# EAGLE design PowerTransmitter (EAGLE 7.5.0)
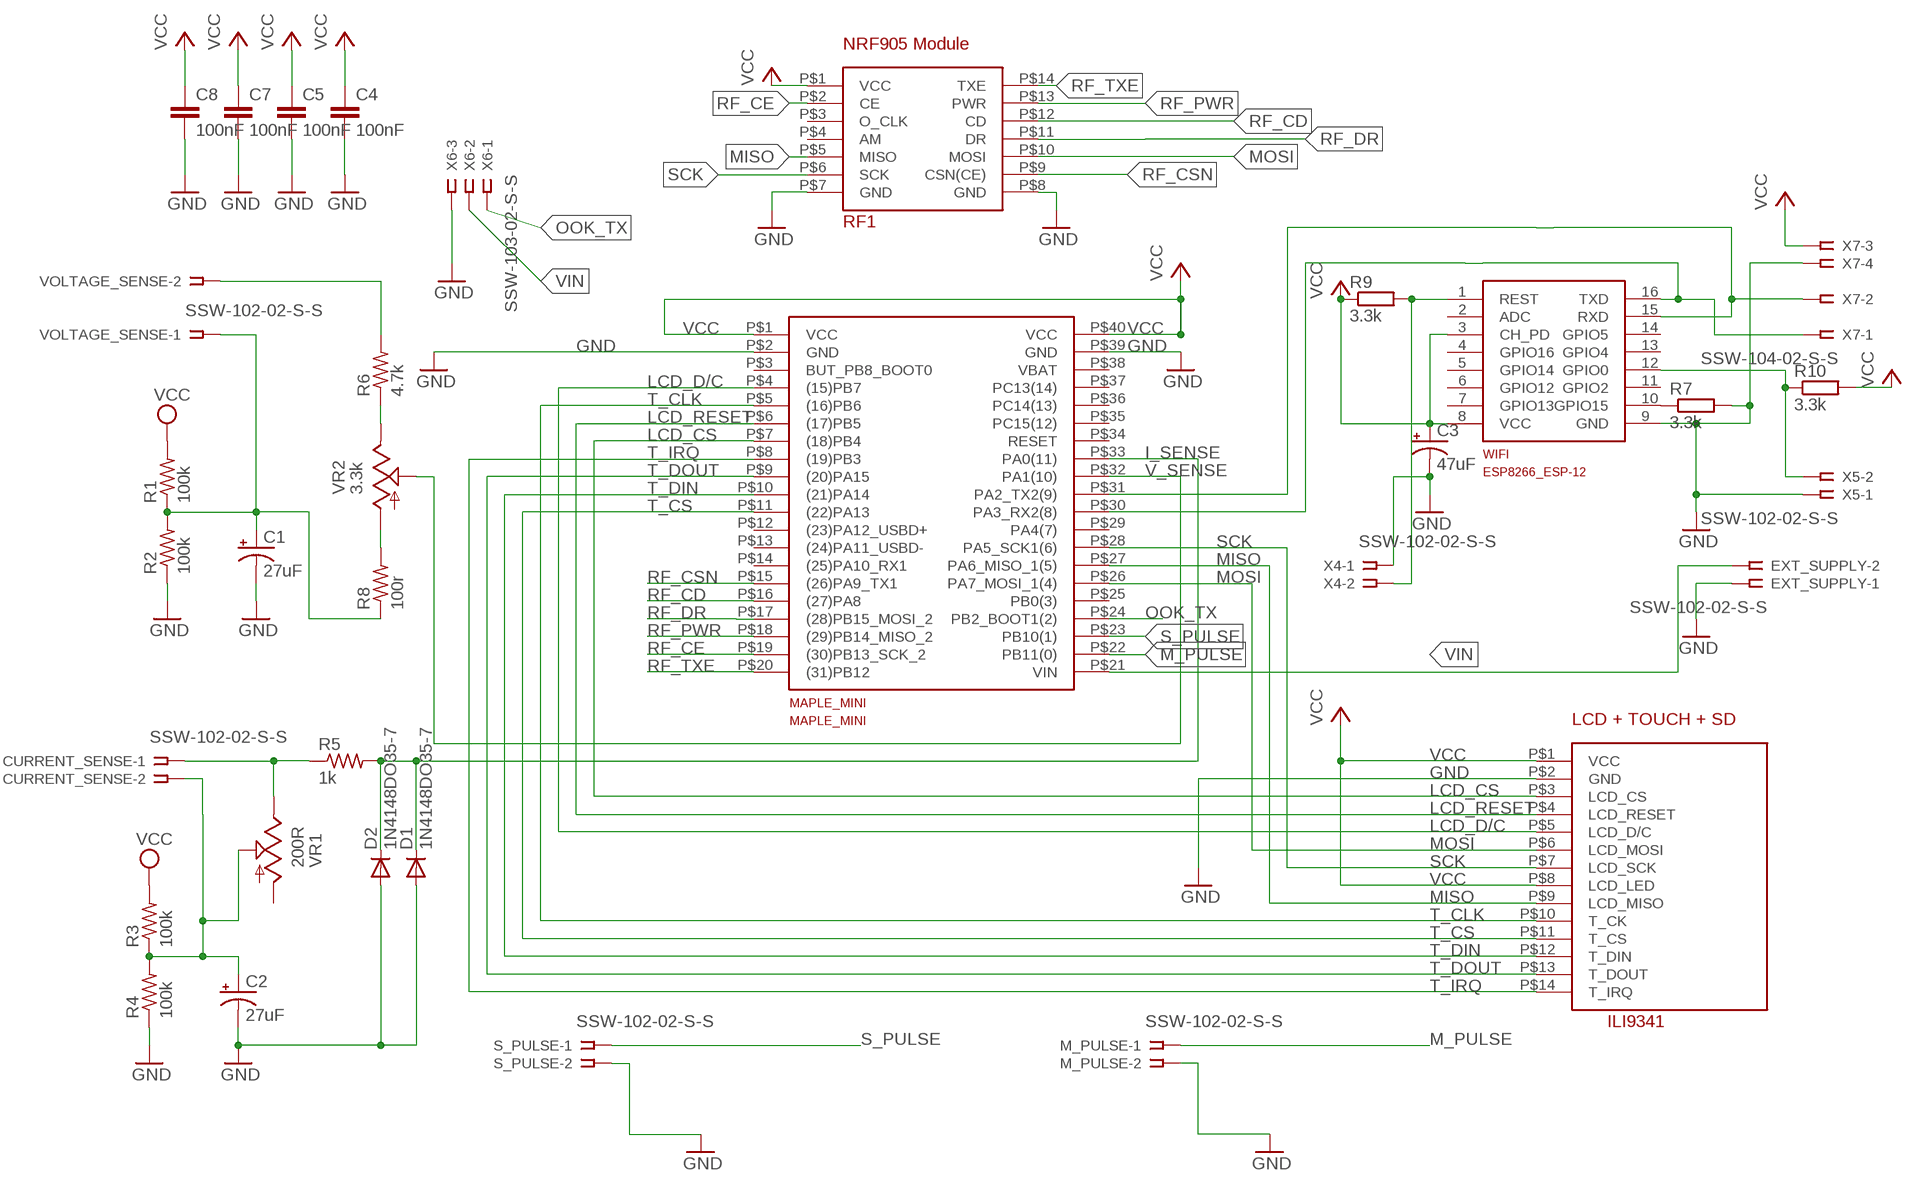
[diagram p0: schematic, sheet 1]

## Parts
C1  27uF  CPOL-USE5-8.5  [E5-8,5]
C2  27uF  CPOL-USE5-8.5  [E5-8,5]
C3  47uF  CPOL-USE5-8.5  [E5-8,5]
C4  100nF  C-EU050-035X075  [C050-035X075]
C5  100nF  C-EU050-035X075  [C050-035X075]
C7  100nF  C-EU050-035X075  [C050-035X075]
C8  100nF  C-EU050-035X075  [C050-035X075]
CURRENT_SENSE  SSW-102-02-S-S  [SSW-102-02-S-S]
D1  1N4148DO35-7  [DO35-7]
D2  1N4148DO35-7  [DO35-7]
EXT_SUPPLY  SSW-102-02-S-S  [SSW-102-02-S-S]
ILI9341  ILI9341_TOUCH_SD  [2.4_INCH]
M_PULSE  SSW-102-02-S-S  [SSW-102-02-S-S]
MAPLE_MINI  MAPLE_MINI  [MAPLE_MINI]
R1  100k  R-US_0207/10  [0207/10]
R2  100k  R-US_0207/10  [0207/10]
R3  100k  R-US_0207/10  [0207/10]
R4  100k  R-US_0207/10  [0207/10]
R5  1k  R-US_0207/10  [0207/10]
R6  4.7k  R-US_0207/10  [0207/10]
R7  3.3k  R-EU_0207/2V  [0207/2V]
R8  100r  R-US_0207/10  [0207/10]
R9  3.3k  R-EU_0207/2V  [0207/2V]
R10  3.3k  R-EU_0207/2V  [0207/2V]
RF1  NRF905_MODULE  [PIN14]
S_PULSE  SSW-102-02-S-S  [SSW-102-02-S-S]
VOLTAGE_SENSE  SSW-102-02-S-S  [SSW-102-02-S-S]
VR1  200R  TRIM_US-CA9V  [CA9V]
VR2  3.3k  TRIM_US-CA9V  [CA9V]
WIFI  ESP8266-12  ESP8266-12GPIO04/05_CORRECTED  [ESP8266-ESP12]
X4  SSW-102-02-S-S  [SSW-102-02-S-S]
X5  SSW-102-02-S-S  [SSW-102-02-S-S]
X6  SSW-103-02-S-S  [SSW-103-02-S-S]
X7  SSW-104-02-S-S  [SSW-104-02-S-S]

## Nets
GND: C1.- C2.- C3.- C4.2 C5.2 C7.2 C8.2 D1.A D2.A EXT_SUPPLY.1 ILI9341.P$2(GND) M_PULSE.2 MAPLE_MINI.P$2(GND) MAPLE_MINI.P$39(GND) R2.1 R4.1 R7.2 RF1.P$7(GND) RF1.P$8(GND) S_PULSE.2 WIFI.9(GND) X4.1 X5.1 X6.3 X7.4
I_SENSE: D1.C D2.C MAPLE_MINI.P$33(PA0(11)) R5.2
LCD_CS: ILI9341.P$3(LCD_CS) MAPLE_MINI.P$7((18)PB4)
LCD_D/C: ILI9341.P$5(LCD_D/C) MAPLE_MINI.P$4((15)PB7)
LCD_RESET: ILI9341.P$4(LCD_RESET) MAPLE_MINI.P$6((17)PB5)
M_PULSE: M_PULSE.1 MAPLE_MINI.P$22(PB11(0))
MISO: ILI9341.P$9(LCD_MISO) MAPLE_MINI.P$27(PA6_MISO_1(5)) RF1.P$5(MISO)
MOSI: ILI9341.P$6(LCD_MOSI) MAPLE_MINI.P$26(PA7_MOSI_1(4)) RF1.P$10(MOSI)
N$1: C1.+ R1.1 R2.2 R8.1 VOLTAGE_SENSE.1
N$2: MAPLE_MINI.P$30(PA3_RX2(8)) WIFI.16(TXD) X7.1
N$3: MAPLE_MINI.P$31(PA2_TX2(9)) WIFI.15(RXD) X7.2
N$4: R6.1 VR2.E
N$5: R6.2 VOLTAGE_SENSE.2
N$6: R8.2 VR2.A
N$7: R7.1 WIFI.10(GPIO15)
N$9: CURRENT_SENSE.1 R5.1 VR1.E
N$11: R9.2 WIFI.1(REST) X4.2
N$12: C2.+ CURRENT_SENSE.2 R3.1 R4.2 VR1.S
N$13: R10.1 WIFI.12(GPIO0) X5.2
OOK_TX: MAPLE_MINI.P$24(PB2_BOOT1(2)) X6.1
RF_CD: MAPLE_MINI.P$16((27)PA8) RF1.P$12(CD)
RF_CE: MAPLE_MINI.P$19((30)PB13_SCK_2) RF1.P$2(CE)
RF_CSN: MAPLE_MINI.P$15((26)PA9_TX1) RF1.P$9(CSN(CE))
RF_DR: MAPLE_MINI.P$17((28)PB15_MOSI_2) RF1.P$11(DR)
RF_PWR: MAPLE_MINI.P$18((29)PB14_MISO_2) RF1.P$13(PWR)
RF_TXE: MAPLE_MINI.P$20((31)PB12) RF1.P$14(TXE)
S_PULSE: MAPLE_MINI.P$23(PB10(1)) S_PULSE.1
SCK: ILI9341.P$7(LCD_SCK) MAPLE_MINI.P$28(PA5_SCK1(6)) RF1.P$6(SCK)
T_CLK: ILI9341.P$10(T_CK) MAPLE_MINI.P$5((16)PB6)
T_CS: ILI9341.P$11(T_CS) MAPLE_MINI.P$11((22)PA13)
T_DIN: ILI9341.P$12(T_DIN) MAPLE_MINI.P$10((21)PA14)
T_DOUT: ILI9341.P$13(T_DOUT) MAPLE_MINI.P$9((20)PA15)
T_IRQ: ILI9341.P$14(T_IRQ) MAPLE_MINI.P$8((19)PB3)
V_SENSE: MAPLE_MINI.P$32(PA1(10)) VR2.S
VCC: C3.+ C4.1 C5.1 C7.1 C8.1 ILI9341.P$1(VCC) ILI9341.P$8(LCD_LED) MAPLE_MINI.P$1(VCC) MAPLE_MINI.P$40(VCC) R1.2 R3.2 R9.1 R10.2 RF1.P$1(VCC) WIFI.3(CH_PD) WIFI.8(VCC) X7.3
VIN: EXT_SUPPLY.2 MAPLE_MINI.P$21(VIN) X6.2
Unconnected: MAPLE_MINI.P$3(BUT_PB8_BOOT0) MAPLE_MINI.P$12((23)PA12_USBD+) MAPLE_MINI.P$13((24)PA11_USBD-) MAPLE_MINI.P$14((25)PA10_RX1) MAPLE_MINI.P$25(PB0(3)) MAPLE_MINI.P$29(PA4(7)) MAPLE_MINI.P$34(RESET) MAPLE_MINI.P$35(PC15(12)) MAPLE_MINI.P$36(PC14(13)) MAPLE_MINI.P$37(PC13(14)) MAPLE_MINI.P$38(VBAT) RF1.P$3(O_CLK) RF1.P$4(AM) VR1.A WIFI.2(ADC) WIFI.4(GPIO16) WIFI.5(GPIO14) WIFI.6(GPIO12) WIFI.7(GPIO13) WIFI.11(GPIO2) WIFI.13(GPIO4) WIFI.14(GPIO5)

## Library data of the parts
C1-C3 = rcl:CPOL-US: POLARIZED CAPACITOR, American symbol
C4 C5 C7 C8 = rcl:C-EU: CAPACITOR, European symbol
CURRENT_SENSE M_PULSE S_PULSE = con-samtec:SSW-102-02-S-S: THROUGH-HOLE .025" SQ POST SOCKET Source: Samtec SSW.pdf; MPN: S1; OC_FARNELL: unknown; OC_NEWARK: 11P9351
D1 D2 = diode:1N4148: DIODE high speed (Philips)
EXT_SUPPLY VOLTAGE_SENSE X4 X5 = con-samtec:SSW-102-02-S-S: THROUGH-HOLE .025" SQ POST SOCKET Source: Samtec SSW.pdf; MPN: SSW-102-02-S-S; OC_FARNELL: unknown; OC_NEWARK: 11P9351
ILI9341 = maple_mini:ILI9341_TOUCH_SD: LCD panel with touch screen and SD card socket
MAPLE_MINI = maple_mini:MAPLE_MINI
R1-R6 R8 = resistor:R-US_: RESISTOR, American symbol
R7 R9 R10 = rcl:R-EU_: RESISTOR, European symbol
RF1 = maple_mini:NRF905_MODULE
VR1 VR2 = pot:TRIM_US-: POTENTIOMETER
WIFI = maple_mini:ESP8266-12: Espressif ESP8266 ESP-12 Module with GPIO04 and GPIO05 corrected.
X6 = con-samtec:SSW-103-02-S-S: THROUGH-HOLE .025" SQ POST SOCKET Source: Samtec SSW.pdf; MPN: SSW-103-02-S-S; OC_FARNELL: unknown; OC_NEWARK: 11P9367
X7 = con-samtec:SSW-104-02-S-S: THROUGH-HOLE .025" SQ POST SOCKET Source: Samtec SSW.pdf; MPN: SSW-104-02-S-S; OC_FARNELL: unknown; OC_NEWARK: 11P9384

## Net classes
0 default: width 0.013 mm, drill 0.025 mm, clearance 0.006 mm

## Board
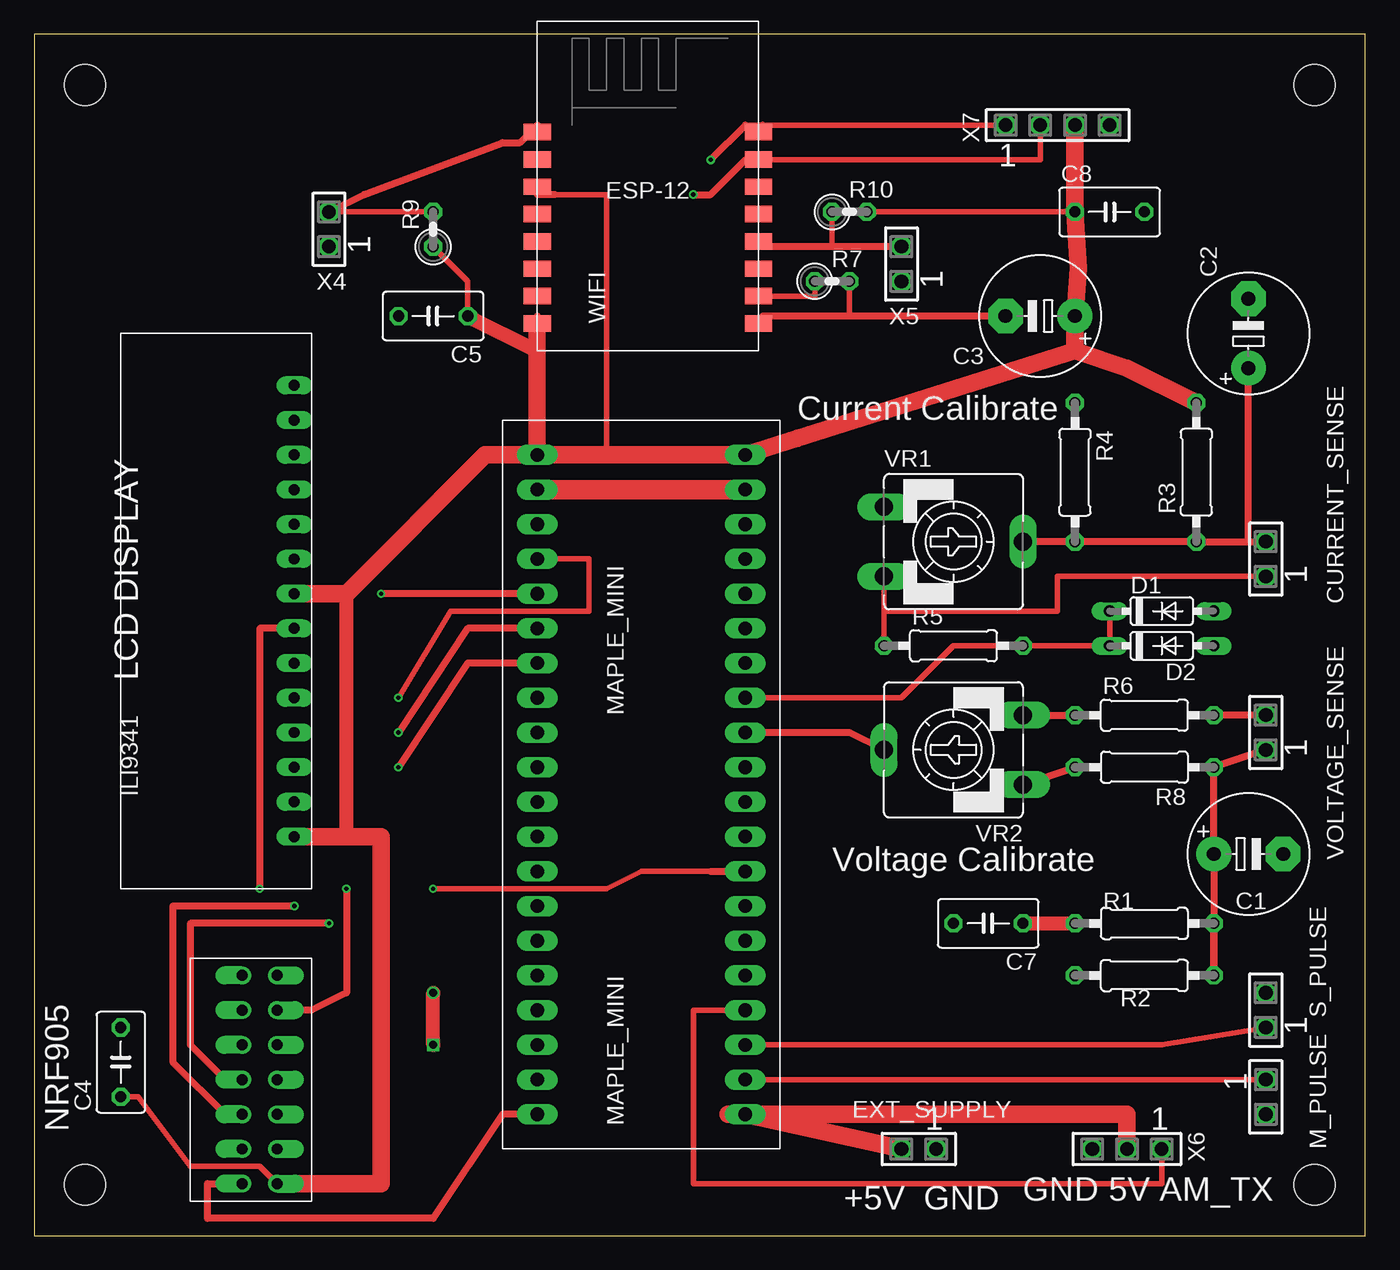
[diagram p1: board, top side]
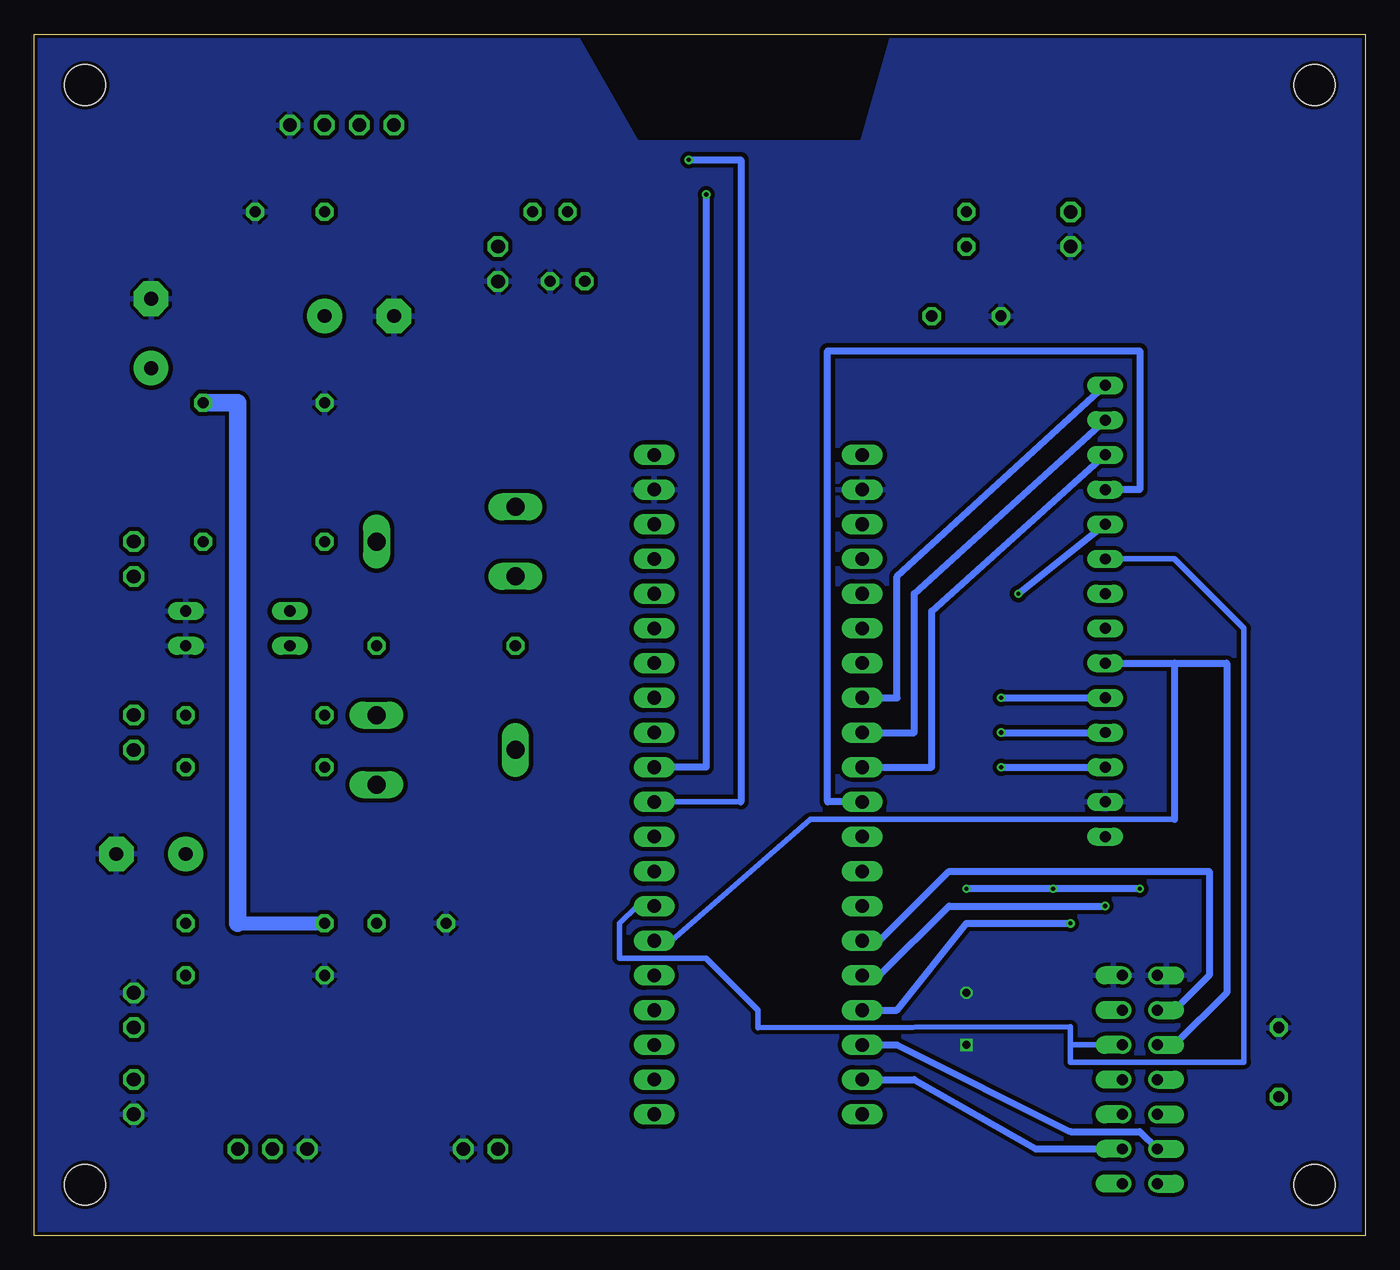
[diagram p2: board, bottom side, seen from below]

Size 97.46 x 87.94 mm. Coordinates in mm from the lower left corner, seen from the top.
Outline: 0,0 97.46,0 97.46,87.94 0,87.94 0,0
Copper layers (1*16): Top 0.035mm / dielectric 1.5mm / Bottom 0.035mm
Design rules "dirt_cheap_dirty_boards.v1 *": minimum track width 5mil, minimum drill 12mil, track to track 12mil, track to pad 12mil, pad to pad 12mil, via to via 12mil, smd to smd 0mil, copper to edge 10mil, drill to drill 10mil, minimum pad ring 10mil, minimum via ring 6mil, stop-mask expansion 2mil, vias tented up to drill 25mil, thermal gap 10mil
Holes 3 mm at 3.73,84.21 93.73,84.21 93.73,3.73 3.73,3.73

### Footprints (pad centres in the part's own frame; a part is rotated, then mirrored left to right if it is on the bottom)
E5-8,5 = drill 1.016 pad 2.54: + -2.54,0 | drill 1.016 pad 2.54 octagon: - 2.54,0
C050-035X075 = drill 0.813 octagon: 1 -2.54,0; 2 2.54,0
SSW-102-02-S-S = drill 1 pad 1.5 octagon: 1 -1.27,0; 2 1.27,0
DO35-7 = drill 0.813 long: A 3.81,0; C -3.81,0
2.4_INCH = drill 0.8 long: P$1 0,0; P$2 0,-2.54; P$3 0,-5.08; P$4 0,-7.62; P$5 0,-10.16; P$6 0,-12.7; P$7 0,-15.24; P$8 0,-17.78; P$9 0,-20.32; P$10 0,-22.86; P$11 0,-25.4; P$12 0,-27.94; P$13 0,-30.48; P$14 0,-33.02
MAPLE_MINI = drill 1 long: P$1 0,0; P$2 0,-2.54; P$3 0,-5.08; P$4 0,-7.62; P$5 0,-10.16; P$6 0,-12.7; P$7 0,-15.24; P$8 0,-17.78; P$9 0,-20.32; P$10 0,-22.86; P$11 0,-25.4; P$12 0,-27.94; P$13 0,-30.48; P$14 0,-33.02; P$15 0,-35.56; P$16 0,-38.1; P$17 0,-40.64; P$18 0,-43.18; P$19 0,-45.72; P$20 0,-48.26; P$21 15.24,-48.26; P$22 15.24,-45.72; P$23 15.24,-43.18; P$24 15.24,-40.64; P$25 15.24,-38.1; P$26 15.24,-35.56; P$27 15.24,-33.02; P$28 15.24,-30.48; P$29 15.24,-27.94; P$30 15.24,-25.4; P$31 15.24,-22.86; P$32 15.24,-20.32; P$33 15.24,-17.78; P$34 15.24,-15.24; P$35 15.24,-12.7; P$36 15.24,-10.16; P$37 15.24,-7.62; P$38 15.24,-5.08; P$39 15.24,-2.54; P$40 15.24,0
0207/10 = drill 0.813 octagon: 1 -5.08,0; 2 5.08,0
0207/2V = drill 0.813 octagon: 1 -1.27,0; 2 1.27,0
PIN14 = drill 0.8 offset: P$1 0,0; P$2 0,-2.54; P$3 0,-5.08; P$4 0,-7.62; P$5 0,-10.16; P$6 0,-12.7; P$7 0,-15.24; P$8 2.54,-15.24; P$9 2.54,-12.7; P$10 2.54,-10.16; P$11 2.54,-7.62; P$12 2.54,-5.08; P$13 2.54,-2.54; P$14 2.54,0
CA9V = drill 1.321 long: A -2.54,-5.08; E 2.54,-5.08; S 0,5.08
ESP8266-ESP12 = smd 2 x 1.2: 1 0,16; 2 0,14; 3 0,12; 4 0,10; 5 0,8; 6 0,6; 7 0,4; 8 0,2; 9 16.2,2; 10 16.2,4; 11 16.2,6; 12 16.2,8; 13 16.2,10; 14 16.2,12; 15 16.2,14; 16 16.2,16
SSW-103-02-S-S = drill 1 pad 1.5 octagon: 1 -2.54,0; 2 0,0; 3 2.54,0
SSW-104-02-S-S = drill 1 pad 1.5 octagon: 1 -3.81,0; 2 -1.27,0; 3 1.27,0; 4 3.81,0

### Placement (x,y rotation side)
C1  88.9,27.94 0 top
C2  88.9,66.04 90 top
C3  73.66,67.31 180 top
C4  6.35,12.7 90 top
C5  29.21,67.31 180 top
C7  69.85,22.86 180 top
C8  78.74,74.93 0 top
CURRENT_SENSE  90.17,49.53 90 top
D1  82.55,45.72 0 top
D2  82.55,43.18 0 top
EXT_SUPPLY  64.77,6.35 180 top
ILI9341  19.05,29.21 180 top
M_PULSE  90.17,10.16 270 top
MAPLE_MINI  36.83,57.15 0 top
R1  81.28,22.86 180 top
R2  81.28,19.05 0 top
R3  85.09,55.88 90 top
R4  76.2,55.88 270 top
R5  67.31,43.18 0 top
R6  81.28,38.1 0 top
R7  58.42,69.85 0 top
R8  81.28,34.29 180 top
R9  29.21,73.66 90 top
R10  59.69,74.93 0 top
RF1  17.78,3.81 180 top
S_PULSE  90.17,16.51 90 top
VOLTAGE_SENSE  90.17,36.83 90 top
VR1  67.31,50.8 270 top
VR2  67.31,35.56 90 top
WIFI  36.83,64.77 0 top
X4  21.59,73.66 90 top
X5  63.5,71.12 90 top
X6  80.01,6.35 180 top
X7  74.93,81.28 0 top

### Tracks (layer width: path | path; a pad name or v marks a point on that pad's centre or on a via)
GND  (via drill 0.6)
  Top 0.406: R7.2 59.69,67.31
  Top 0.508: C3.- 59.69,67.31 53.34,67.31 WIFI.9
  Top 1.016: v29.21,13.97 v29.21,17.78
  Top 1.422: MAPLE_MINI.P$2 MAPLE_MINI.P$39
  Bottom 0.508: MAPLE_MINI.P$39 52.07,54.66
  pour Bottom: -1.27,88.9 34.29,88.9 36.83,80.01 53.34,80.01 58.42,88.9 99.06,88.9 99.06,-2.54 -1.27,-2.54
I_SENSE
  Top 0.406: D1.C D2.C R5.2 67.31,43.18 63.5,39.37 MAPLE_MINI.P$33
LCD_CS  (via drill 0.3)
  Top 0.508: v26.67,34.29 31.75,41.91 MAPLE_MINI.P$7
  Bottom 0.508: v26.67,34.29 ILI9341.P$3
LCD_D/C  (via drill 0.3)
  Top 0.406: v26.67,39.37 30.48,45.72 40.64,45.72 40.64,49.53 MAPLE_MINI.P$4
  Bottom 0.508: v26.67,39.37 ILI9341.P$5
LCD_RESET  (via drill 0.3)
  Top 0.508: v26.67,36.83 31.75,44.45 MAPLE_MINI.P$6
  Bottom 0.508: v26.67,36.83 ILI9341.P$4
M_PULSE
  Top 0.406: M_PULSE.1 MAPLE_MINI.P$22
MISO
  Bottom 0.406: RF1.P$5 21.59,13.97 | MAPLE_MINI.P$27 53.34,24.13 54.61,22.86 54.61,20.32 48.26,20.32 44.45,16.51 44.45,15.24 21.59,15.29 21.59,13.97 | 21.59,13.97 21.59,12.7 8.89,12.7 8.89,44.45 13.97,49.53 ILI9341.P$9
MOSI
  Bottom 0.406: 50.8,21.59 40.64,30.48 13.97,30.48
  Bottom 0.508: RF1.P$10 13.97,13.97 10.16,17.78 10.16,41.91 13.97,41.91 | ILI9341.P$6 13.97,41.91 | 50.8,21.59 MAPLE_MINI.P$26 | 13.97,41.91 13.97,30.48
N$1
  Top 0.508: VOLTAGE_SENSE.1 R8.1 C1.+ R2.2 R1.1
N$2  (via drill 0.3)
  Top 0.406: X7.1 53.34,81.28 52.07,81.28
  Top 0.508: 53.34,81.28 WIFI.16 52.07,81.28 v49.53,78.74
  Bottom 0.406: 45.72,31.75 MAPLE_MINI.P$30
  Bottom 0.508: 45.72,31.75 45.72,78.74 v49.53,78.74
N$3  (via drill 0.3)
  Top 0.406: X7.2 73.66,78.74 53.34,78.74
  Top 0.508: 53.34,78.74 WIFI.15 52.07,78.74 49.53,76.2 v48.26,76.2
  Bottom 0.508: MAPLE_MINI.P$31 48.26,34.29 v48.26,76.2
N$4
  Top 0.508: VR2.E R6.1
N$5
  Top 0.508: VOLTAGE_SENSE.2 R6.2
N$6
  Top 0.508: VR2.A R8.2
N$7
  Top 0.406: WIFI.10 57.15,68.77 R7.1
N$8
  Top 0.406: 53.28,68.57 53.07,68.78
N$9
  Top 0.406: CURRENT_SENSE.1 74.93,48.26 74.93,45.72 62.23,45.72 VR1.E R5.1
N$11
  Top 0.406: R9.2 X4.2
  Top 0.508: X4.2 24.13,76.2 34.29,80.01 35.56,80.01 36.83,81.28 WIFI.1
N$12
  Top 0.508: 88.9,50.8 R3.1 R4.2 VR1.S | 88.9,50.8 CURRENT_SENSE.2 | 88.9,50.8 C2.+
N$13
  Top 0.406: R10.1 58.42,72.39
  Top 0.508: X5.2 58.42,72.39 53.34,72.39 WIFI.12
OOK_TX
  Top 0.406: X6.1 82.55,3.81 48.26,3.81 48.26,16.51 MAPLE_MINI.P$24
RF_CD  (via drill 0.3)
  Top 0.508: RF1.P$12 13.97,8.89 10.16,12.7 10.16,24.13 v19.05,24.13
  Bottom 0.508: v19.05,24.13 30.48,24.13 35.56,19.05 MAPLE_MINI.P$16
RF_CE
  Bottom 0.508: RF1.P$2 24.13,6.35 33.02,11.43 MAPLE_MINI.P$19
RF_CSN
  Bottom 0.508: RF1.P$9 13.97,16.51 11.43,19.05 11.43,26.67 30.48,26.67 35.56,21.59 MAPLE_MINI.P$15
RF_DR  (via drill 0.3)
  Top 0.508: RF1.P$11 13.97,11.43 11.43,13.97 11.43,22.86 v21.59,22.86
  Bottom 0.508: v21.59,22.86 29.21,22.86 34.29,16.51 MAPLE_MINI.P$17
RF_PWR
  Bottom 0.508: MAPLE_MINI.P$18 34.29,13.97 21.59,7.62 16.51,7.62 RF1.P$13
RF_TXE
  Top 0.508: RF1.P$14 12.7,3.81 12.7,1.27 29.21,1.27 34.29,8.89 MAPLE_MINI.P$20
S_PULSE
  Top 0.406: MAPLE_MINI.P$23 82.55,13.97 S_PULSE.1
SCK  (via drill 0.3)
  Top 0.406: 49.53,26.67 44.45,26.67 41.91,25.4 v29.21,25.4
  Top 0.508: RF1.P$6 20.32,16.51 22.86,17.78 v22.86,25.4 | v16.51,25.4 16.51,44.45 ILI9341.P$7 | 49.53,26.67 MAPLE_MINI.P$28
  Bottom 0.508: v16.51,25.4 v22.86,25.4 v29.21,25.4
T_CLK  (via drill 0.3)
  Top 0.508: MAPLE_MINI.P$5 v25.4,46.99
  Bottom 0.508: v25.4,46.99 ILI9341.P$10
T_CS
  Bottom 0.508: ILI9341.P$11 16.51,54.61 16.51,64.77 39.37,64.77 39.37,31.75 MAPLE_MINI.P$11
T_DIN
  Bottom 0.508: ILI9341.P$12 31.75,45.72 31.75,34.29 MAPLE_MINI.P$10
T_DOUT
  Bottom 0.508: ILI9341.P$13 33.02,46.99 33.02,36.83 MAPLE_MINI.P$9
T_IRQ
  Bottom 0.508: ILI9341.P$14 34.29,48.26 34.29,39.37 MAPLE_MINI.P$8
V_SENSE
  Top 0.508: MAPLE_MINI.P$32 59.69,36.83 VR2.S
VCC
  Top 0.406: RF1.P$1 16.51,5.08 11.43,5.08 7.62,10.16 C4.1 | 38.1,76.2 41.91,76.2 41.91,57.15 | C5.1 31.75,69.85 R9.1 | C8.1 R10.2
  Top 0.508: 19.05,3.81 RF1.P$1 | 36.83,67.31 WIFI.8 | MAPLE_MINI.P$1 35.56,57.15 | 38.1,76.2 36.83,76.2 WIFI.3 | 55.88,58.42 55.9,58.36
  Top 1.016: 22.86,29.21 22.86,46.99 | C7.1 R1.2 | C5.1 36.83,64.77
  Top 1.27: 19.05,3.81 25.4,3.81 25.4,29.21 22.86,29.21 ILI9341.P$1 | MAPLE_MINI.P$1 36.83,64.77 WIFI.8 | MAPLE_MINI.P$1 41.91,57.15 MAPLE_MINI.P$40 55.9,58.36 76.2,64.77 | R3.2 80.01,63.5 76.2,64.77 | 76.2,64.77 C3.+ 76.46,70.76 C8.1 X7.3 | MAPLE_MINI.P$1 33.02,57.15 22.86,46.99 ILI9341.P$8
  Bottom 1.016: 82.55,22.86 R1.2
  Bottom 1.27: 82.55,22.86 82.55,60.96 R3.2
VIN
  Top 0.508: MAPLE_MINI.P$21 50.8,8.89
  Top 1.27: 50.8,8.89 80.01,8.89 X6.2 | MAPLE_MINI.P$21 EXT_SUPPLY.2

### Text on the board
tPlace: Current Calibrate | LCD DISPLAY | Voltage Calibrate | NRF905 | GND 5V AM_TX | +5V GND